# EAGLE schematic PissbotV6 (EAGLE 9.6.1)
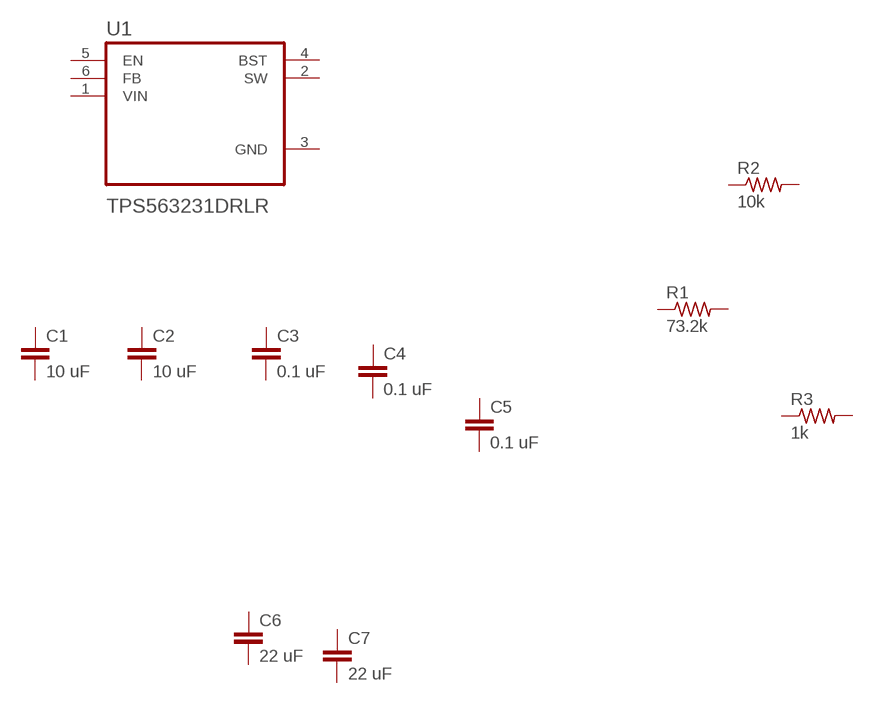
[diagram p0: schematic, sheet 1]

## Parts
C1  10 uF  C-EUC0805  [C0805]
C2  10 uF  C-EUC0805  [C0805]
C3  0.1 uF  C-EUC0603  [C0603]
C4  0.1 uF  C-EUC0603  [C0603]
C5  0.1 uF  C-EUC0603  [C0603]
C6  22 uF  C-EUC0603K  [C0603K]
C7  22 uF  C-EUC0603K  [C0603K]
R1  73.2k  R-US_R0603  [R0603]
R2  10k  R-US_R0603  [R0603]
R3  1k  R-US_R0805  [R0805]
U1  TPS563231DRLR  [SOT50P160X60-6N]
Unconnected: C1.1 C1.2 C2.1 C2.2 C3.1 C3.2 C4.1 C4.2 C5.1 C5.2 C6.1 C6.2 C7.1 C7.2 R1.1 R1.2 R2.1 R2.2 R3.1 R3.2 U1.1(VIN) U1.2(SW) U1.4(BST) U1.5(EN) U1.6(FB)

## Power pins joined to a net without a drawn wire
GND: U1.3(GND)

## Library data of the parts
C1-C7 = rcl:C-EU: CAPACITOR, European symbol; SPICEPREFIX: C
R1-R3 = rcl:R-US_: RESISTOR, American symbol; SPICEPREFIX: R
U1 = TPS563231DRLR:TPS563231DRLR: Buy Part <https://snapeda.com/parts/TPS563231DRLT/Texas%20Instruments/view-part/?ref=eda>; AVAILABILITY: Unavailable; DESCRIPTION: 4.5-V to 17-V input, 3-A synchronous step-down voltage regulator 6-SOT-5X3 -40 to 125; MF: Texas Instruments; MP: TPS563231DRLR; PACKAGE: SOT-5X3-6 Texas Instruments; PRICE: None; PURCHASE-URL: https://pricing.snapeda.com/search/part/TPS563231DRLR/?ref=eda